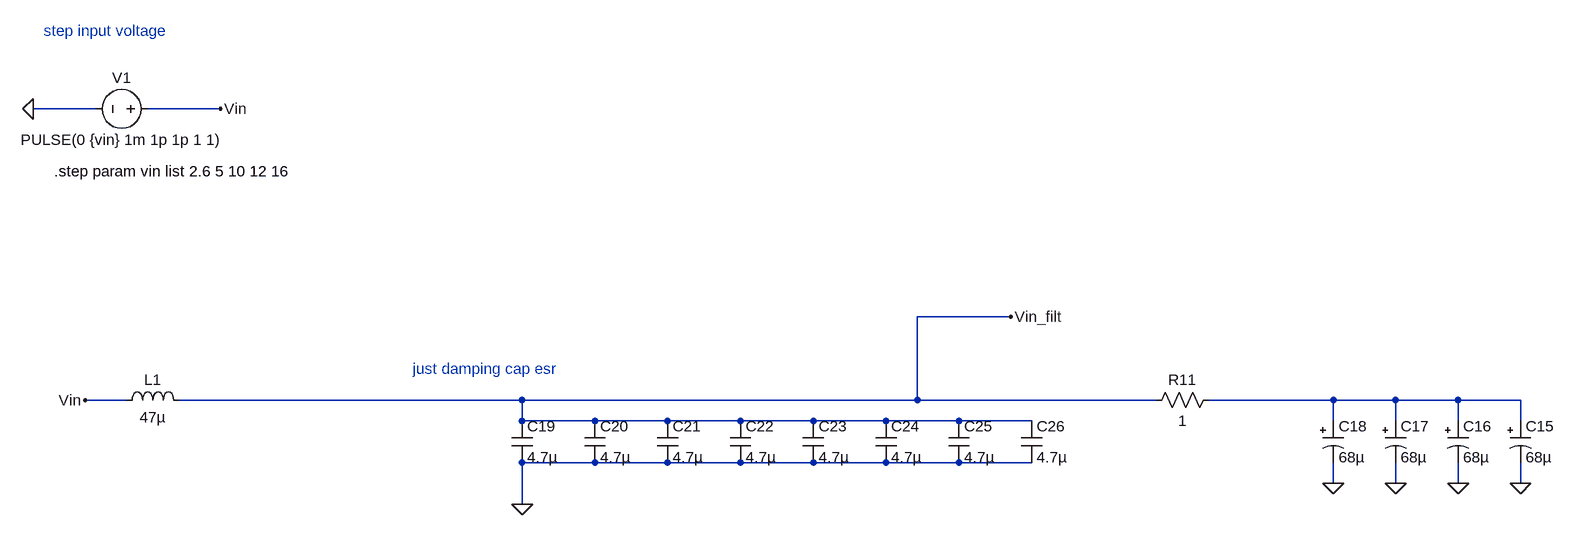
[diagram p0: schematic infilt.asc]
infilt.asc, the LTspice schematic file:
Version 4
SHEET 1 3408 1092
WIRE -1296 -1344 -1392 -1344
WIRE -1104 -1344 -1216 -1344
WIRE 112 -1024 -32 -1024
WIRE -1248 -896 -1312 -896
WIRE -640 -896 -1168 -896
WIRE -32 -896 -32 -1024
WIRE -32 -896 -640 -896
WIRE 336 -896 -32 -896
WIRE 608 -896 416 -896
WIRE 704 -896 608 -896
WIRE 800 -896 704 -896
WIRE 896 -896 800 -896
WIRE -640 -864 -640 -896
WIRE -528 -864 -640 -864
WIRE -416 -864 -528 -864
WIRE -304 -864 -416 -864
WIRE -192 -864 -304 -864
WIRE -80 -864 -192 -864
WIRE 32 -864 -80 -864
WIRE 144 -864 32 -864
WIRE 608 -864 608 -896
WIRE 704 -864 704 -896
WIRE 800 -864 800 -896
WIRE 896 -864 896 -896
WIRE -528 -800 -640 -800
WIRE -416 -800 -528 -800
WIRE -304 -800 -416 -800
WIRE -192 -800 -304 -800
WIRE -80 -800 -192 -800
WIRE 32 -800 -80 -800
WIRE 144 -800 32 -800
WIRE 608 -768 608 -800
WIRE 704 -768 704 -800
WIRE 800 -768 800 -800
WIRE 896 -768 896 -800
WIRE -640 -736 -640 -800
FLAG -1392 -1344 0
FLAG -1104 -1344 Vin
FLAG -640 -736 0
FLAG 896 -768 0
FLAG 800 -768 0
FLAG 704 -768 0
FLAG 608 -768 0
FLAG -1312 -896 Vin
FLAG 112 -1024 Vin_filt
SYMBOL voltage -1200 -1344 R90
WINDOW 0 -32 56 VBottom 2
WINDOW 3 32 56 VTop 2
WINDOW 123 0 0 Left 0
WINDOW 39 0 0 Left 0
SYMATTR InstName V1
SYMATTR Value PULSE(0 {vin} 1m 1p 1p 1 1)
SYMBOL ind -1264 -880 R270
WINDOW 0 32 56 VTop 2
WINDOW 3 5 56 VBottom 2
SYMATTR InstName L1
SYMATTR Value 47µ
SYMATTR SpiceLine Rser=13.42m
SYMBOL polcap 880 -864 R0
SYMATTR InstName C15
SYMATTR Value 68µ
SYMATTR SpiceLine Rser=700m
SYMBOL polcap 784 -864 R0
SYMATTR InstName C16
SYMATTR Value 68µ
SYMATTR SpiceLine Rser=700m
SYMBOL polcap 688 -864 R0
SYMATTR InstName C17
SYMATTR Value 68µ
SYMATTR SpiceLine Rser=700m
SYMBOL polcap 592 -864 R0
SYMATTR InstName C18
SYMATTR Value 68µ
SYMATTR SpiceLine Rser=700m
SYMBOL res 432 -912 R90
WINDOW 0 0 56 VBottom 2
WINDOW 3 32 56 VTop 2
SYMATTR InstName R11
SYMATTR Value 1
SYMBOL cap -656 -864 R0
SYMATTR InstName C19
SYMATTR Value 4.7µ
SYMBOL cap -544 -864 R0
SYMATTR InstName C20
SYMATTR Value 4.7µ
SYMBOL cap -432 -864 R0
SYMATTR InstName C21
SYMATTR Value 4.7µ
SYMBOL cap -320 -864 R0
SYMATTR InstName C22
SYMATTR Value 4.7µ
SYMBOL cap -208 -864 R0
SYMATTR InstName C23
SYMATTR Value 4.7µ
SYMBOL cap -96 -864 R0
SYMATTR InstName C24
SYMATTR Value 4.7µ
SYMBOL cap 16 -864 R0
SYMATTR InstName C25
SYMATTR Value 4.7µ
SYMBOL cap 128 -864 R0
SYMATTR InstName C26
SYMATTR Value 4.7µ
TEXT -808 -944 Left 2 ;just damping cap esr
TEXT -1360 -1248 Left 2 !.step param vin list 2.6 5 10 12 16
TEXT -1376 -1464 Left 2 ;step input voltage

The netlist it stands for:
* infilt.asc
V1 Vin 0 PULSE(0 {vin} 1m 1p 1p 1 1)
L1 Vin Vin_filt 47µ Rser=13.42m
C15 N001 0 68µ Rser=700m
C16 N001 0 68µ Rser=700m
C17 N001 0 68µ Rser=700m
C18 N001 0 68µ Rser=700m
R11 N001 Vin_filt 1
C19 Vin_filt 0 4.7µ
C20 Vin_filt 0 4.7µ
C21 Vin_filt 0 4.7µ
C22 Vin_filt 0 4.7µ
C23 Vin_filt 0 4.7µ
C24 Vin_filt 0 4.7µ
C25 Vin_filt 0 4.7µ
C26 Vin_filt 0 4.7µ
* just damping cap esr
.step param vin list 2.6 5 10 12 16
* step input voltage
.backanno
.end